# EAGLE schematic UV LED Lamp (EAGLE 9.6.2)
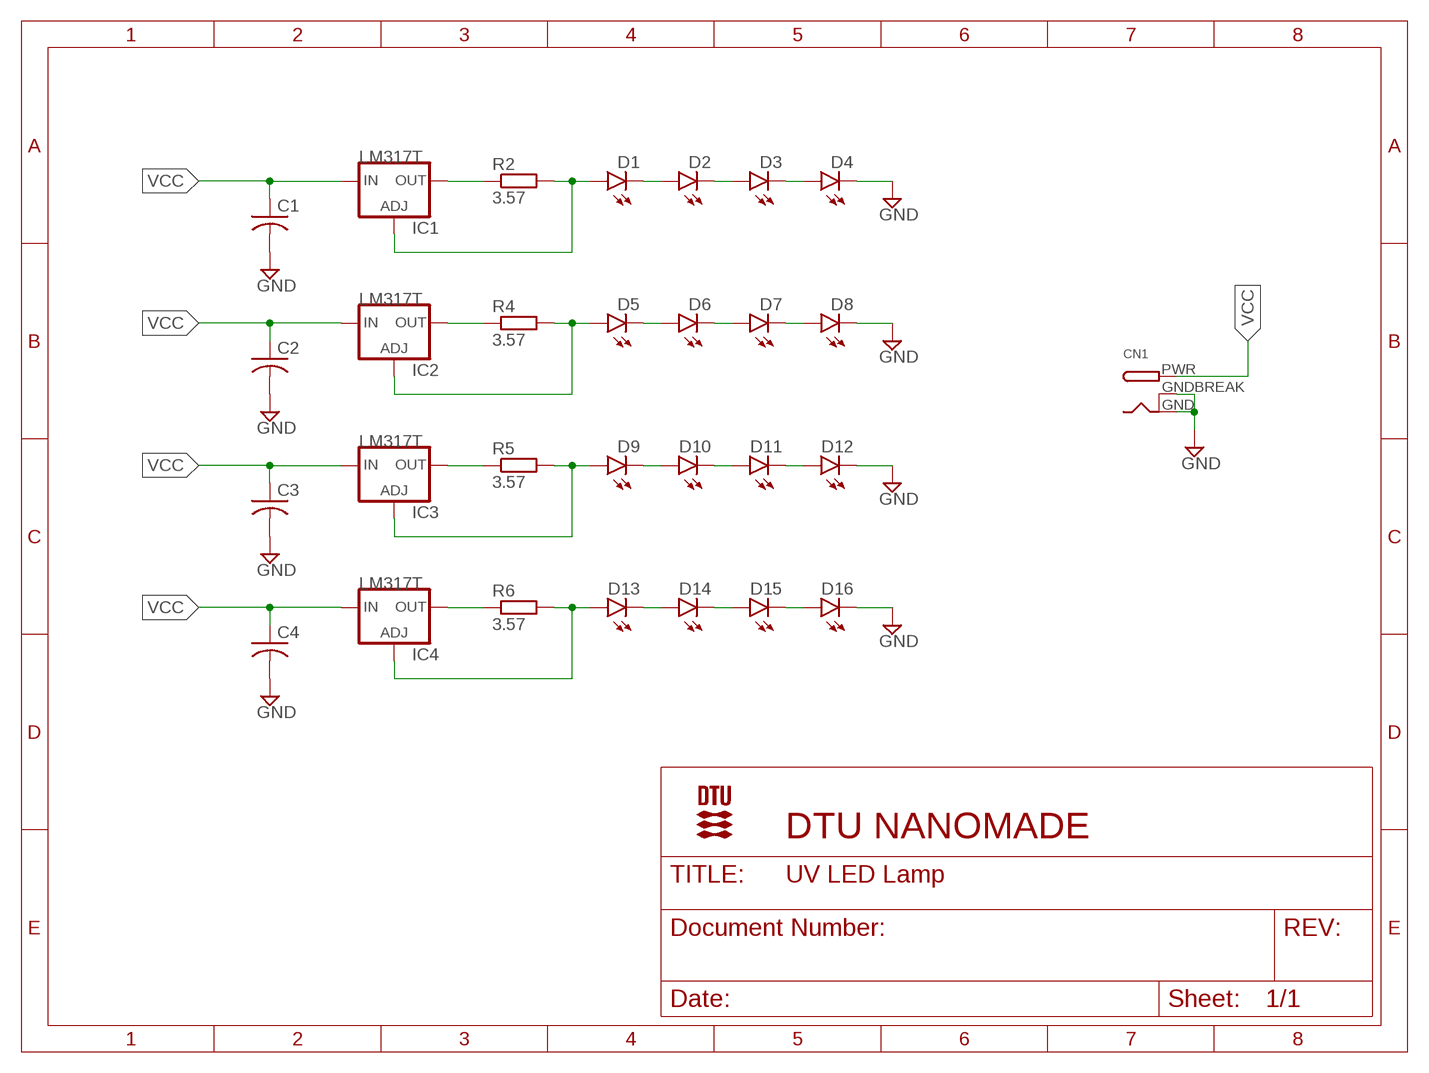
[diagram p0: schematic, sheet 1]

## Parts
C1  C-USC0805K  [C0805K]
C2  C-USC0805K  [C0805K]
C3  C-USC0805K  [C0805K]
C4  C-USC0805K  [C0805K]
CN1  DCBARRELPTH  [DCJACK_2MM_PTH]
D1  PM2L-1LLE-LC  [PM2L-1LLE-LC]
D2  PM2L-1LLE-LC  [PM2L-1LLE-LC]
D3  PM2L-1LLE-LC  [PM2L-1LLE-LC]
D4  PM2L-1LLE-LC  [PM2L-1LLE-LC]
D5  PM2L-1LLE-LC  [PM2L-1LLE-LC]
D6  PM2L-1LLE-LC  [PM2L-1LLE-LC]
D7  PM2L-1LLE-LC  [PM2L-1LLE-LC]
D8  PM2L-1LLE-LC  [PM2L-1LLE-LC]
D9  PM2L-1LLE-LC  [PM2L-1LLE-LC]
D10  PM2L-1LLE-LC  [PM2L-1LLE-LC]
D11  PM2L-1LLE-LC  [PM2L-1LLE-LC]
D12  PM2L-1LLE-LC  [PM2L-1LLE-LC]
D13  PM2L-1LLE-LC  [PM2L-1LLE-LC]
D14  PM2L-1LLE-LC  [PM2L-1LLE-LC]
D15  PM2L-1LLE-LC  [PM2L-1LLE-LC]
D16  PM2L-1LLE-LC  [PM2L-1LLE-LC]
IC1  LM317T  LM317TL  [317TL]
IC2  LM317T  LM317TL  [317TL]
IC3  LM317T  LM317TL  [317TL]
IC4  LM317T  LM317TL  [317TL]
R2  3.57  R-EU_0207/7  [0207/7]
R4  3.57  R-EU_0207/7  [0207/7]
R5  3.57  R-EU_0207/7  [0207/7]
R6  3.57  R-EU_0207/7  [0207/7]
U$1  DTU_LOGO  [DTU_LOGO]
U$2  DTU_LOGO  [DTU_LOGO]

## Nets
GND [POWER]: C1.2 C2.2 C3.2 C4.2 CN1.GND CN1.GNDBREAK D4.P$1(C) D8.P$1(C) D12.P$1(C) D16.P$1(C)
N$1: D1.P$1(C) D2.P$2(A)
N$2: D2.P$1(C) D3.P$2(A)
N$3: D3.P$1(C) D4.P$2(A)
N$4: IC1.2(OUT) R2.1
N$5: D6.P$1(C) D7.P$2(A)
N$6: D7.P$1(C) D8.P$2(A)
N$7: IC2.2(OUT) R4.1
N$8: D9.P$1(C) D10.P$2(A)
N$9: D14.P$1(C) D15.P$2(A)
N$10: D13.P$1(C) D14.P$2(A)
N$11: IC3.2(OUT) R5.1
N$12: D11.P$1(C) D12.P$2(A)
N$13: D5.P$1(C) D6.P$2(A)
N$14: D10.P$1(C) D11.P$2(A)
N$15: D15.P$1(C) D16.P$2(A)
N$16: IC4.2(OUT) R6.1
N$17: D1.P$2(A) IC1.1(ADJ) R2.2
N$18: D5.P$2(A) IC2.1(ADJ) R4.2
N$19: D9.P$2(A) IC3.1(ADJ) R5.2
N$20: D13.P$2(A) IC4.1(ADJ) R6.2
VCC [POWER]: C1.1 C2.1 C3.1 C4.1 CN1.PWR IC1.3(IN) IC2.3(IN) IC3.3(IN) IC4.3(IN)

## Notes on the sheet
- DTU NANOMADE

## Library data of the parts
C1-C4 = rcl:C-US: CAPACITOR, American symbol; SPICEPREFIX: C
CN1 = adafruit:DCBARREL: 2.0mm DC Barrel Jack DCJACK_2MM_PTH - Through Hole Jack (4UConnector: 05537)
D1-D16 = DTU Nanomade:PM2L-1LLE-LC: ProLight PM2L-1LLx-LC - 1W UV Power LED Technical Specifications: Forward Voltage: 3.4V @ 350mA, 25C RS: 894-7667, DATASHEET <https://docs.rs-online.com/1223/0900766b81443a20.pdf>; DATASHEET: https://docs.rs-online.com/1223/0900766b81443a20.pdf
IC1-IC4 = Electronics:LM317TL: VOLTAGE REGULATOR
R2 R4-R6 = rcl:R-EU_: RESISTOR, European symbol; SPICEPREFIX: R
U$1 U$2 = Logotypes:DTU_LOGO: DTU Logo

## Net classes
0 default: width 0.305 mm, clearance 0.305 mm
1 POWER: width 1.016 mm, clearance 0.508 mm